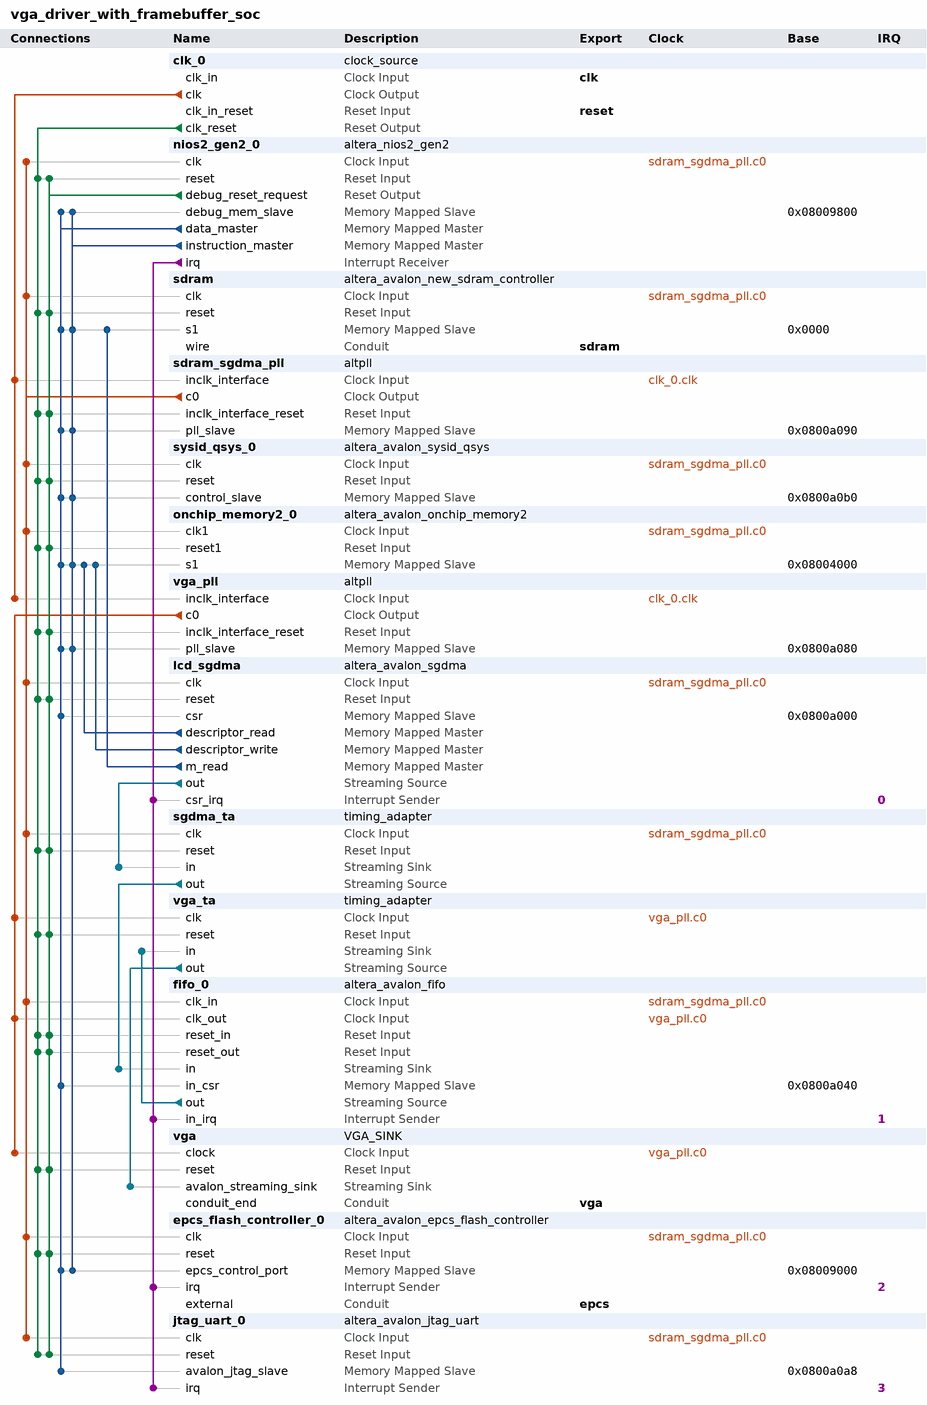
[diagram p0: system contents]
# Platform Designer (Qsys) system vga_driver_with_framebuffer_soc, Cyclone IV E EP4CE115F29C7
# Parameters at their usual value, and those the tool derives, are not listed.
package require -exact qsys 18.1
create_system vga_driver_with_framebuffer_soc
set_project_property DEVICE_FAMILY {Cyclone IV E}
set_project_property DEVICE EP4CE115F29C7

add_instance clk_0 clock_source 18.1
set_instance_parameter_value clk_0 clockFrequency 50000000

add_instance nios2_gen2_0 altera_nios2_gen2 18.1
set_instance_parameter_value nios2_gen2_0 dcache_size 2048
set_instance_parameter_value nios2_gen2_0 exceptionSlave sdram.s1
set_instance_parameter_value nios2_gen2_0 icache_size 4096
set_instance_parameter_value nios2_gen2_0 impl Fast
set_instance_parameter_value nios2_gen2_0 resetSlave sdram.s1

add_instance sdram altera_avalon_new_sdram_controller 18.1
set_instance_parameter_value sdram TAC 5.5
set_instance_parameter_value sdram TRCD 20.0
set_instance_parameter_value sdram TRP 20.0
set_instance_parameter_value sdram casLatency 3
set_instance_parameter_value sdram columnWidth 10
set_instance_parameter_value sdram dataWidth 32
set_instance_parameter_value sdram generateSimulationModel false
set_instance_parameter_value sdram model single_Micron_MT48LC4M32B2_7_chip
set_instance_parameter_value sdram numberOfBanks 4
set_instance_parameter_value sdram numberOfChipSelects 1
set_instance_parameter_value sdram powerUpDelay 200.0
set_instance_parameter_value sdram refreshPeriod 7.8125
set_instance_parameter_value sdram rowWidth 13

add_instance sdram_sgdma_pll altpll 18.1
set_instance_parameter_value sdram_sgdma_pll CLK0_DIVIDE_BY 1
set_instance_parameter_value sdram_sgdma_pll CLK0_MULTIPLY_BY 2
set_instance_parameter_value sdram_sgdma_pll CLK1_DIVIDE_BY 1
set_instance_parameter_value sdram_sgdma_pll CLK1_DUTY_CYCLE 50
set_instance_parameter_value sdram_sgdma_pll CLK1_MULTIPLY_BY 2
set_instance_parameter_value sdram_sgdma_pll CLK1_PHASE_SHIFT -5000
set_instance_parameter_value sdram_sgdma_pll INCLK0_INPUT_FREQUENCY 20000
set_instance_parameter_value sdram_sgdma_pll PORT_ARESET PORT_UNUSED
set_instance_parameter_value sdram_sgdma_pll PORT_LOCKED PORT_UNUSED
set_instance_parameter_value sdram_sgdma_pll PORT_clk1 PORT_USED
set_instance_parameter_value sdram_sgdma_pll PORT_clk2 PORT_UNUSED
set_instance_parameter_value sdram_sgdma_pll PORT_clk3 PORT_UNUSED

add_instance sysid_qsys_0 altera_avalon_sysid_qsys 18.1
set_instance_parameter_value sysid_qsys_0 id 0

add_instance onchip_memory2_0 altera_avalon_onchip_memory2 18.1
set_instance_parameter_value onchip_memory2_0 dataWidth 32
set_instance_parameter_value onchip_memory2_0 dualPort false
set_instance_parameter_value onchip_memory2_0 initMemContent true
set_instance_parameter_value onchip_memory2_0 initializationFileName onchip_mem.hex
set_instance_parameter_value onchip_memory2_0 memorySize 16384

add_instance vga_pll altpll 18.1
set_instance_parameter_value vga_pll CLK0_DIVIDE_BY 2
set_instance_parameter_value vga_pll CLK0_MULTIPLY_BY 1
set_instance_parameter_value vga_pll INCLK0_INPUT_FREQUENCY 20000
set_instance_parameter_value vga_pll PORT_ARESET PORT_UNUSED
set_instance_parameter_value vga_pll PORT_LOCKED PORT_UNUSED
set_instance_parameter_value vga_pll PORT_clk1 PORT_UNUSED
set_instance_parameter_value vga_pll PORT_clk2 PORT_UNUSED
set_instance_parameter_value vga_pll PORT_clk3 PORT_UNUSED

add_instance lcd_sgdma altera_avalon_sgdma 18.1
set_instance_parameter_value lcd_sgdma enableBurstTransfers false
set_instance_parameter_value lcd_sgdma enableUnalignedTransfers false
set_instance_parameter_value lcd_sgdma readBlockDataWidth 32
set_instance_parameter_value lcd_sgdma sinkErrorWidth 0
set_instance_parameter_value lcd_sgdma sourceErrorWidth 0
set_instance_parameter_value lcd_sgdma transferMode MEMORY_TO_STREAM
set_instance_parameter_value lcd_sgdma writeBurstcountWidth 4

add_instance sgdma_ta timing_adapter 18.1
set_instance_parameter_value sgdma_ta inBitsPerSymbol 8
set_instance_parameter_value sgdma_ta inChannelWidth 0
set_instance_parameter_value sgdma_ta inErrorWidth 0
set_instance_parameter_value sgdma_ta inMaxChannel 0
set_instance_parameter_value sgdma_ta inReadyLatency 0
set_instance_parameter_value sgdma_ta inSymbolsPerBeat 4
set_instance_parameter_value sgdma_ta inUseEmptyPort YES
set_instance_parameter_value sgdma_ta inUsePackets true
set_instance_parameter_value sgdma_ta inUseReady true
set_instance_parameter_value sgdma_ta inUseValid true
set_instance_parameter_value sgdma_ta outReadyLatency 1
set_instance_parameter_value sgdma_ta outUseReady true
set_instance_parameter_value sgdma_ta outUseValid true

add_instance vga_ta timing_adapter 18.1
set_instance_parameter_value vga_ta inBitsPerSymbol 8
set_instance_parameter_value vga_ta inChannelWidth 0
set_instance_parameter_value vga_ta inErrorWidth 0
set_instance_parameter_value vga_ta inMaxChannel 0
set_instance_parameter_value vga_ta inReadyLatency 0
set_instance_parameter_value vga_ta inSymbolsPerBeat 4
set_instance_parameter_value vga_ta inUseEmptyPort YES
set_instance_parameter_value vga_ta inUsePackets true
set_instance_parameter_value vga_ta inUseReady true
set_instance_parameter_value vga_ta inUseValid true
set_instance_parameter_value vga_ta outReadyLatency 1
set_instance_parameter_value vga_ta outUseReady true
set_instance_parameter_value vga_ta outUseValid true

add_instance fifo_0 altera_avalon_fifo 18.1
set_instance_parameter_value fifo_0 bitsPerSymbol 8
set_instance_parameter_value fifo_0 channelWidth 0
set_instance_parameter_value fifo_0 errorWidth 0
set_instance_parameter_value fifo_0 fifoDepth 512
set_instance_parameter_value fifo_0 fifoInputInterfaceOptions AVALONST_SINK
set_instance_parameter_value fifo_0 fifoOutputInterfaceOptions AVALONST_SOURCE
set_instance_parameter_value fifo_0 singleClockMode false
set_instance_parameter_value fifo_0 symbolsPerBeat 4
set_instance_parameter_value fifo_0 useIRQ true
set_instance_parameter_value fifo_0 usePacket true
set_instance_parameter_value fifo_0 useReadControl false

add_instance vga VGA_SINK 1.0
set_instance_parameter_value vga BITS_PER_SYMBOL 8
set_instance_parameter_value vga H_BPORCH 48
set_instance_parameter_value vga H_DISP 640
set_instance_parameter_value vga H_FPORCH 16
set_instance_parameter_value vga H_SYNC 96
set_instance_parameter_value vga MAX_CHANNEL 0
set_instance_parameter_value vga READY_LATENCY 0
set_instance_parameter_value vga SYMBOLS_PER_BEAT 4
set_instance_parameter_value vga V_BPORCH 33
set_instance_parameter_value vga V_DISP 480
set_instance_parameter_value vga V_FPORCH 10
set_instance_parameter_value vga V_SYNC 2

add_instance epcs_flash_controller_0 altera_avalon_epcs_flash_controller 18.1
set_instance_parameter_value epcs_flash_controller_0 resetrequest_enabled true

add_instance jtag_uart_0 altera_avalon_jtag_uart 18.1
set_instance_parameter_value jtag_uart_0 simInteractiveOptions NO_INTERACTIVE_WINDOWS

# connections
add_connection clk_0.clk sdram_sgdma_pll.inclk_interface clock
add_connection clk_0.clk vga_pll.inclk_interface clock
add_connection sdram_sgdma_pll.c0 epcs_flash_controller_0.clk clock
add_connection sdram_sgdma_pll.c0 fifo_0.clk_in clock
add_connection sdram_sgdma_pll.c0 jtag_uart_0.clk clock
add_connection sdram_sgdma_pll.c0 lcd_sgdma.clk clock
add_connection sdram_sgdma_pll.c0 nios2_gen2_0.clk clock
add_connection sdram_sgdma_pll.c0 onchip_memory2_0.clk1 clock
add_connection sdram_sgdma_pll.c0 sdram.clk clock
add_connection sdram_sgdma_pll.c0 sgdma_ta.clk clock
add_connection sdram_sgdma_pll.c0 sysid_qsys_0.clk clock
add_connection vga_pll.c0 fifo_0.clk_out clock
add_connection vga_pll.c0 vga.clock clock
add_connection vga_pll.c0 vga_ta.clk clock
add_connection clk_0.clk_reset epcs_flash_controller_0.reset reset
add_connection clk_0.clk_reset fifo_0.reset_in reset
add_connection clk_0.clk_reset fifo_0.reset_out reset
add_connection clk_0.clk_reset jtag_uart_0.reset reset
add_connection clk_0.clk_reset lcd_sgdma.reset reset
add_connection clk_0.clk_reset nios2_gen2_0.reset reset
add_connection clk_0.clk_reset onchip_memory2_0.reset1 reset
add_connection clk_0.clk_reset sdram.reset reset
add_connection clk_0.clk_reset sdram_sgdma_pll.inclk_interface_reset reset
add_connection clk_0.clk_reset sgdma_ta.reset reset
add_connection clk_0.clk_reset sysid_qsys_0.reset reset
add_connection clk_0.clk_reset vga.reset reset
add_connection clk_0.clk_reset vga_pll.inclk_interface_reset reset
add_connection clk_0.clk_reset vga_ta.reset reset
add_connection nios2_gen2_0.debug_reset_request epcs_flash_controller_0.reset reset
add_connection nios2_gen2_0.debug_reset_request fifo_0.reset_in reset
add_connection nios2_gen2_0.debug_reset_request fifo_0.reset_out reset
add_connection nios2_gen2_0.debug_reset_request jtag_uart_0.reset reset
add_connection nios2_gen2_0.debug_reset_request lcd_sgdma.reset reset
add_connection nios2_gen2_0.debug_reset_request nios2_gen2_0.reset reset
add_connection nios2_gen2_0.debug_reset_request onchip_memory2_0.reset1 reset
add_connection nios2_gen2_0.debug_reset_request sdram.reset reset
add_connection nios2_gen2_0.debug_reset_request sdram_sgdma_pll.inclk_interface_reset reset
add_connection nios2_gen2_0.debug_reset_request sgdma_ta.reset reset
add_connection nios2_gen2_0.debug_reset_request sysid_qsys_0.reset reset
add_connection nios2_gen2_0.debug_reset_request vga.reset reset
add_connection nios2_gen2_0.debug_reset_request vga_pll.inclk_interface_reset reset
add_connection nios2_gen2_0.debug_reset_request vga_ta.reset reset
add_connection lcd_sgdma.descriptor_read onchip_memory2_0.s1 avalon
set_connection_parameter_value lcd_sgdma.descriptor_read/onchip_memory2_0.s1 baseAddress 0x08004000
add_connection lcd_sgdma.descriptor_write onchip_memory2_0.s1 avalon
set_connection_parameter_value lcd_sgdma.descriptor_write/onchip_memory2_0.s1 baseAddress 0x08004000
add_connection lcd_sgdma.m_read sdram.s1 avalon
set_connection_parameter_value lcd_sgdma.m_read/sdram.s1 baseAddress 0x0000
add_connection nios2_gen2_0.data_master epcs_flash_controller_0.epcs_control_port avalon
set_connection_parameter_value nios2_gen2_0.data_master/epcs_flash_controller_0.epcs_control_port baseAddress 0x08009000
add_connection nios2_gen2_0.data_master fifo_0.in_csr avalon
set_connection_parameter_value nios2_gen2_0.data_master/fifo_0.in_csr baseAddress 0x0800a040
add_connection nios2_gen2_0.data_master jtag_uart_0.avalon_jtag_slave avalon
set_connection_parameter_value nios2_gen2_0.data_master/jtag_uart_0.avalon_jtag_slave baseAddress 0x0800a0a8
add_connection nios2_gen2_0.data_master lcd_sgdma.csr avalon
set_connection_parameter_value nios2_gen2_0.data_master/lcd_sgdma.csr baseAddress 0x0800a000
add_connection nios2_gen2_0.data_master nios2_gen2_0.debug_mem_slave avalon
set_connection_parameter_value nios2_gen2_0.data_master/nios2_gen2_0.debug_mem_slave baseAddress 0x08009800
add_connection nios2_gen2_0.data_master onchip_memory2_0.s1 avalon
set_connection_parameter_value nios2_gen2_0.data_master/onchip_memory2_0.s1 baseAddress 0x08004000
add_connection nios2_gen2_0.data_master sdram.s1 avalon
set_connection_parameter_value nios2_gen2_0.data_master/sdram.s1 baseAddress 0x0000
add_connection nios2_gen2_0.data_master sdram_sgdma_pll.pll_slave avalon
set_connection_parameter_value nios2_gen2_0.data_master/sdram_sgdma_pll.pll_slave baseAddress 0x0800a090
add_connection nios2_gen2_0.data_master sysid_qsys_0.control_slave avalon
set_connection_parameter_value nios2_gen2_0.data_master/sysid_qsys_0.control_slave baseAddress 0x0800a0b0
add_connection nios2_gen2_0.data_master vga_pll.pll_slave avalon
set_connection_parameter_value nios2_gen2_0.data_master/vga_pll.pll_slave baseAddress 0x0800a080
add_connection nios2_gen2_0.instruction_master epcs_flash_controller_0.epcs_control_port avalon
set_connection_parameter_value nios2_gen2_0.instruction_master/epcs_flash_controller_0.epcs_control_port baseAddress 0x08009000
add_connection nios2_gen2_0.instruction_master nios2_gen2_0.debug_mem_slave avalon
set_connection_parameter_value nios2_gen2_0.instruction_master/nios2_gen2_0.debug_mem_slave baseAddress 0x08009800
add_connection nios2_gen2_0.instruction_master onchip_memory2_0.s1 avalon
set_connection_parameter_value nios2_gen2_0.instruction_master/onchip_memory2_0.s1 baseAddress 0x08004000
add_connection nios2_gen2_0.instruction_master sdram.s1 avalon
set_connection_parameter_value nios2_gen2_0.instruction_master/sdram.s1 baseAddress 0x0000
add_connection nios2_gen2_0.instruction_master sdram_sgdma_pll.pll_slave avalon
set_connection_parameter_value nios2_gen2_0.instruction_master/sdram_sgdma_pll.pll_slave baseAddress 0x0800a090
add_connection nios2_gen2_0.instruction_master sysid_qsys_0.control_slave avalon
set_connection_parameter_value nios2_gen2_0.instruction_master/sysid_qsys_0.control_slave baseAddress 0x0800a0b0
add_connection nios2_gen2_0.instruction_master vga_pll.pll_slave avalon
set_connection_parameter_value nios2_gen2_0.instruction_master/vga_pll.pll_slave baseAddress 0x0800a080
add_connection fifo_0.out vga_ta.in avalon_streaming
add_connection lcd_sgdma.out sgdma_ta.in avalon_streaming
add_connection sgdma_ta.out fifo_0.in avalon_streaming
add_connection vga_ta.out vga.avalon_streaming_sink avalon_streaming
add_connection nios2_gen2_0.irq epcs_flash_controller_0.irq interrupt
set_connection_parameter_value nios2_gen2_0.irq/epcs_flash_controller_0.irq irqNumber 2
add_connection nios2_gen2_0.irq fifo_0.in_irq interrupt
set_connection_parameter_value nios2_gen2_0.irq/fifo_0.in_irq irqNumber 1
add_connection nios2_gen2_0.irq jtag_uart_0.irq interrupt
set_connection_parameter_value nios2_gen2_0.irq/jtag_uart_0.irq irqNumber 3
add_connection nios2_gen2_0.irq lcd_sgdma.csr_irq interrupt
set_connection_parameter_value nios2_gen2_0.irq/lcd_sgdma.csr_irq irqNumber 0

# exported interfaces
add_interface clk clock sink
set_interface_property clk EXPORT_OF clk_0.clk_in
add_interface epcs conduit end
set_interface_property epcs EXPORT_OF epcs_flash_controller_0.external
add_interface reset reset sink
set_interface_property reset EXPORT_OF clk_0.clk_in_reset
add_interface sdram conduit end
set_interface_property sdram EXPORT_OF sdram.wire
add_interface vga conduit end
set_interface_property vga EXPORT_OF vga.conduit_end

set_interconnect_requirement {$system} qsys_mm.clockCrossingAdapter HANDSHAKE
set_interconnect_requirement {$system} qsys_mm.enableEccProtection FALSE
set_interconnect_requirement {$system} qsys_mm.insertDefaultSlave FALSE
set_interconnect_requirement {$system} qsys_mm.maxAdditionalLatency 1

save_system vga_driver_with_framebuffer_soc.qsys
